# Altium project Bevattningssystem.PrjPcb
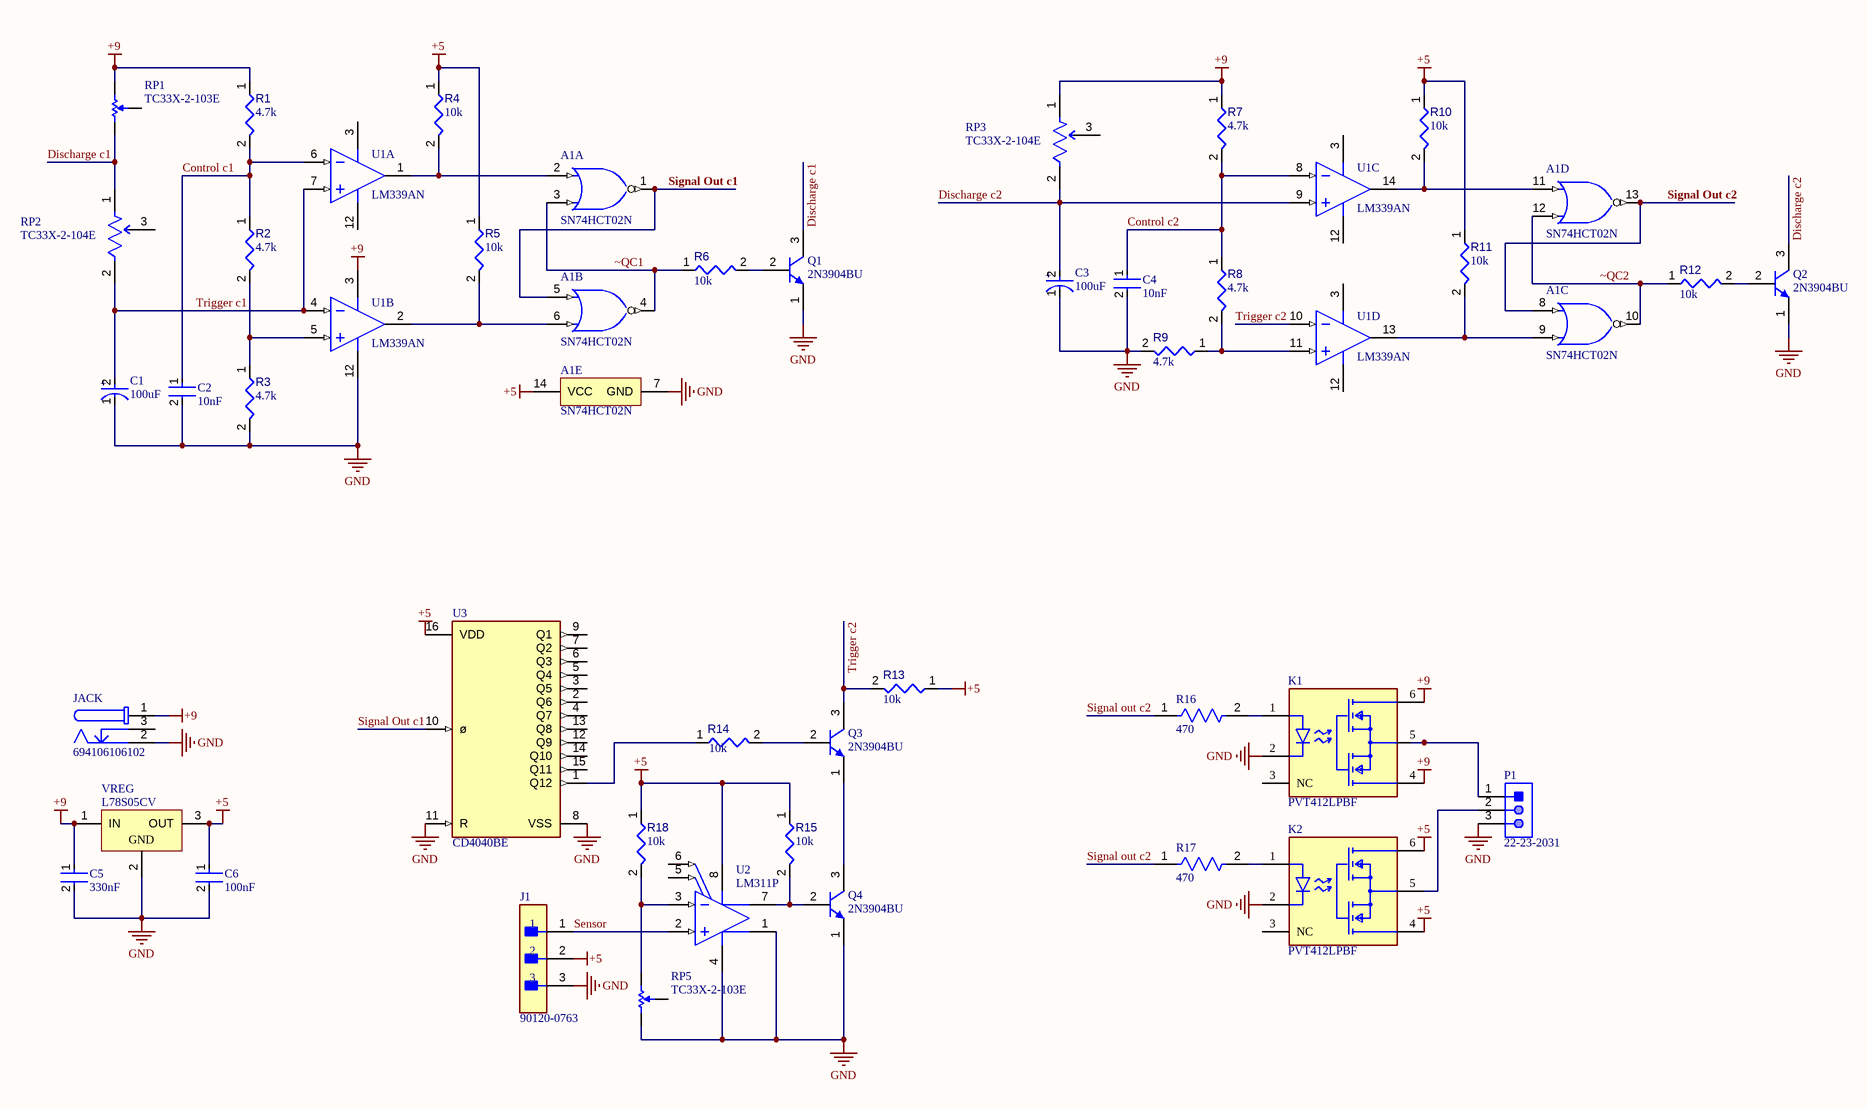
[diagram p0: Bevattningssystem.SchDoc]
1 sheet, 42 parts. Net scope: global (net labels, ports and power ports of the same name join across sheets).
Board file: Bevattningssystem.PcbDoc

## Sheet Bevattningssystem.SchDoc
size 431 x 279 mm; Organization: ORGANIZATION; Address1: ADDRESS 1; Address2: ADDRESS 2; Address3: ADDRESS 3; Address4: ADDRESS 4; Revision: -; SheetNumber: 1; SheetTotal: 1; ENG_APP_DATE: --/--/--; DSN_APP_DATE: --/--/--; CHK_APP_DATE: --/--/--

### Parts
A1  SN74HCT02N  [N0014A]  (parts A,B,C,D,E of 5)
C1  Capacitance: 100uF  [FP-RAD-TH-D_6_3_0_5-L_11-MFG]  (hidden comment: ECA1EHG101I)
C2  Capacitance: 10nF  [FP-GCM319-0_15-MFG]  (hidden comment: GCM3195C2A103JA16D)
C3  Capacitance: 100uF  [FP-RAD-TH-D_6_3_0_5-L_11-MFG]  (hidden comment: ECA1EHG101I)
C4  Capacitance: 10nF  [FP-GCM319-0_15-MFG]  (hidden comment: GCM3195C2A103JA16D)
C5  value 330nF  [FP-GCM31M-0_15-IPC_B]  (hidden comment: GCM31MR91H334KA37L)
C6  value 100nF  [FP-GRM31C-0_2-e0_3_0_8-IPC_C]  (hidden comment: GRM31C5C1H104JA01L)
J1  90120-0763  [FP-90120-0763-MFG]
JACK  694106106102  [694106106102]
K1  PVT412LPBF  [FP-PG-DIP-6-MFG]
K2  PVT412LPBF  [FP-PG-DIP-6-MFG]
P1  22-23-2031  [MOLX-22-23-2031_V]
Q1  2N3904BU  [FAIR-TO-92]
Q2  2N3904BU  [FAIR-TO-92]
Q3  2N3904BU  [FAIR-TO-92]
Q4  2N3904BU  [FAIR-TO-92]
R1  value 4.7k  [RESC3116X70X50ML13T20]  (hidden comment: Resistor 4k7 +/-1% 1206 250 mW)
R2  value 4.7k  [RESC3116X70X50ML13T20]  (hidden comment: Resistor 4k7 +/-1% 1206 250 mW)
R3  value 4.7k  [RESC3116X70X50ML13T20]  (hidden comment: Resistor 4k7 +/-1% 1206 250 mW)
R4  value 10k  [RESC3216X60X45ML15T20]  (hidden comment: Resistor 10k +/-1% 1206 250 mW)
R5  value 10k  [RESC3216X60X45ML15T20]  (hidden comment: Resistor 10k +/-1% 1206 250 mW)
R6  value 10k  [RESC3216X60X45ML15T20]  (hidden comment: Resistor 10k +/-1% 1206 250 mW)
R7  value 4.7k  [RESC3116X70X50ML13T20]  (hidden comment: Resistor 4k7 +/-1% 1206 250 mW)
R8  value 4.7k  [RESC3116X70X50ML13T20]  (hidden comment: Resistor 4k7 +/-1% 1206 250 mW)
R9  value 4.7k  [RESC3116X70X50ML13T20]  (hidden comment: Resistor 4k7 +/-1% 1206 250 mW)
R10  value 10k  [RESC3216X60X45ML15T20]  (hidden comment: Resistor 10k +/-1% 1206 250 mW)
R11  value 10k  [RESC3216X60X45ML15T20]  (hidden comment: Resistor 10k +/-1% 1206 250 mW)
R12  value 10k  [RESC3216X60X45ML15T20]  (hidden comment: Resistor 10k +/-1% 1206 250 mW)
R13  value 10k  [RESC3216X60X45ML15T20]  (hidden comment: Resistor 10k +/-1% 1206 250 mW)
R14  value 10k  [RESC3216X60X45ML15T20]  (hidden comment: Resistor 10k +/-1% 1206 250 mW)
R15  value 10k  [RESC3216X60X45ML15T20]  (hidden comment: Resistor 10k +/-1% 1206 250 mW)
R16  value 470  [FP-RT1206-IPC_C]  (hidden comment: RT1206BRD07470RL)
R17  value 470  [FP-RT1206-IPC_C]  (hidden comment: RT1206BRD07470RL)
R18  value 10k  [RESC3216X60X45ML15T20]  (hidden comment: Resistor 10k +/-1% 1206 250 mW)
RP1  TC33X-2-103E  [BOUR-TC33X-2_V]
RP2  TC33X-2-104E  [FP-TC33X-2-MFG]
RP3  TC33X-2-104E  [FP-TC33X-2-MFG]
RP5  TC33X-2-103E  [BOUR-TC33X-2_V]
U1  LM339AN  [TI-N0014A]  (parts A,B,C,D of 4)
U2  LM311P  [P0008A]
U3  CD4040BE  [FP-N0016A-MFG]
VREG  L78S05CV  [TO220]

### Nets
+5: A1.14(VCC) C6.1 J1.2 K2.4(2_DRAIN) K2.6(1_DRAIN) R4.1 R5.1 R10.1 R11.1 R13.1 R15.1 R18.1 U2.8(VCC+) U3.16(VDD) VREG.3(OUT)
+9: C5.1 JACK.1 K1.4(2_DRAIN) K1.6(1_DRAIN) R1.1 R7.1 RP1.2 RP3.1(CCW) U1.3(VCC) VREG.1(IN)
GND: A1.7(GND) C1.1(C) C2.2 C3.1(C) C4.2 C5.2 C6.2 J1.3 JACK.2 K1.2(C) K2.2(C) P1.3 Q1.1(E) Q2.1(E) Q4.1(E) R3.2 R9.2 RP5.1 U1.12(GND) U2.1(EMIT_OUT) U2.4(VCC-) U3.8(VSS) U3.11(R) VREG.2(GND)
Control c1: C2.1 R1.2 R2.1 U1.6(IN1-)
Control c2: C4.1 R7.2 R8.1 U1.8(IN3-)
Discharge c1: Q1.3(C) RP1.3 RP2.1(CCW)
Discharge c2: C3.2(A) Q2.3(C) RP3.2(WIPER) U1.9(IN3+)
Sensor: J1.1 U2.2(IN+)
Signal Out c1: A1.1(1Y) A1.5(2A) U3.10(ø)
Signal Out c2: A1.8(3A) A1.13(4Y) R16.1 R17.1
Trigger c1: C1.2(A) RP2.2(WIPER) U1.4(IN2-) U1.7(IN1+)
Trigger c2: Q3.3(C) R13.2 U1.10(IN4-)
~QC1: A1.3(1B) A1.4(2Y) R6.1
~QC2: A1.10(3Y) A1.12(4B) R12.1
NetA1_2: A1.2(1A) R4.2 U1.1(OUT1)
NetA1_6: A1.6(2B) R5.2 U1.2(OUT2)
NetA1_9: A1.9(3B) R11.2 U1.13(OUT4)
NetA1_11: A1.11(4A) R10.2 U1.14(OUT3)
NetK1_1: K1.1(A) R16.2
NetK1_5: K1.5(COMMON_SOURCE) P1.1
NetK2_1: K2.1(A) R17.2
NetK2_5: K2.5(COMMON_SOURCE) P1.2
NetQ1_2: Q1.2(B) R6.2
NetQ2_2: Q2.2(B) R12.2
NetQ3_1: Q3.1(E) Q4.3(C)
NetQ3_2: Q3.2(B) R14.2
NetQ4_2: Q4.2(B) R15.2 U2.7(COL_OUT)
NetR2_2: R2.2 R3.1 U1.5(IN2+)
NetR8_2: R8.2 R9.1 U1.11(IN4+)
NetR14_1: R14.1 U3.1(Q12)
NetR18_2: R18.2 RP5.3 U2.3(IN-)

Not connected (* = marked no-connect by the designer): JACK 3; K1 3(NC); K2 3(NC); RP1 1; RP2 3(CW); RP3 3(CW); RP5 2; U2 5(BALANCE) 6(BAL/STRB); U3 2(Q6) 3(Q5) 4(Q7) 5(Q4) 6(Q3) 7(Q2) 9(Q1) 12(Q9) 13(Q8) 14(Q10) 15(Q11)

### Notes on the sheet
- DWG. NO.
- REV.
- SHT.
- THIS DOCUMENT AND THE DATA DISCLOSED HEREIN OR HEREWITH IS THE PROPERTY OF ALTIUM LIMITED AND MAY BE FREELY DISTRIBUTED IN WHOLE. NO RIGHTS ARE RESERVED OR EXPRESS OR IMPLIED WARANTEE GIVEN.
- REVISION
- DESCRIPTION
- DATE
- APPROVED
- ENG:
- APPROVALS
- PROJECT
- DSN:
- CHK:
- REFERENCE DOCUMENTS
- PROJECT REVISION:
- TITLE
- DOCUMENT REVISION:
- DESIGN ITEM:
- BOM:
- FAB DWG:
- PCB DWG:
- ASSY DWG:
- SCALE:
- SIZE
- B
- CAGE CODE
- FILE NAME
- DWG NO.
- SHEET
- OF
- REV
- (in symbol CMP-05427-000141-1) +

### Library data of the parts
A1 = CMP-016-00012-1: NOR Gate, HCT Series, 4-Func, 2-Input, CMOS, PDIP14; Channels: 4; Load Capacitance (CL): 50pF; Max I(ol): 4mA; Max Supply Voltage: 5.5V; Min Supply Voltage: 4.5V; Nominal Supply Voltage: 5V; Number of Inputs: 2; Package Body Material: Plastic; Package Equivalence Code: DIP14,.3; Prop. Delay@Nom-Sup: 25ns; Qualification Status: Not Qualified; Schmitt Trigger: No; Surface Mount: No; Case/Package: DIP; Height - Seated (Max): 5.08mm; JESD-30 Code: R-PDIP-T14; JESD-609 Code: e4; Length: 19.305mm; Logic Type: NOR GATE; Max Operating Temperature: 85°C; Min Operating Temperature: -40°C; Package Shape: Rectangular; Package Style: IN-LINEMeter; Packaging: Rail/Tube; Pins: 14; Power Supplies: 5V; Propagation Delay (tpd): 25ns; Reach SVHC Compliant: Yes; RoHS Compliant: Yes; Technology: CMOS; Temperature Grade: INDUSTRIAL; Terminal Finish: Nickel; Terminal Form: Through Hole; Terminal Pitch: 2.54mm; Terminal Position: DUAL; Width: 7.62mm
C1 C3 = CMP-05427-000141-1: Aluminum Electrolytic Capacitors (Radial Lead Type) AEC-Q200 Qualified 100uF ±20% 25V; Lead Diameter: 0.5mm; Life (Hours): 1000Hour; Ripple Current: 130mA; Lead/Base Style: Straight; Construction: RADIAL; Radiation Hardening: No; Packaging: Ammo Pack; Termination: Radial; Mount: Through Hole; Lead Pitch: 2.5mm; Tolerance: 20%; Height - Seated (Max): 0.48inch; Height: 11.2mm; Max Operating Temperature: 105°C; Length: 11.2mm; Diameter: 6.3mm; RoHS Compliant: Yes; Voltage Rating: 25V; Min Operating Temperature: -55°C; Package Quantity: 2000; Width: 6.3mm; Voltage Rating (DC): 25V; Series: NHG; Contact Plating: Tin; Case/Package: Radial
C2 C4 = CMP-06035-000082-2: Ceramic Capacitor for Automotive 10nF ±5% 100VDC C0G 1206 Paper T/R; Voltage Rating (DC): 100V; Case/Package: 1206; Min Operating Temperature: -55°C; Width: 0.063inch; Packaging: Tape and Reel; Package Quantity: 1; Case Code (Metric): 3216; Thickness: 0.037inch; Case Code (Imperial): 1206; Dielectric: C0G; Radiation Hardening: No; Length: 3.2mm; Termination: SMD/SMT; Height: 0.85mm; Max Operating Temperature: 125°C; Depth: 1.6mm; Ratings: AEC-Q200; Tolerance: 5%; Voltage Rating: 100V; Mount: Surface Mount; Lead Free: Lead Free
C5 = CMP-001-00102-1: Ceramic Capacitor, Multilayer, Ceramic, 50V, 10% +Tol, 10% -Tol, X8R, 15% TC, 0.33uF, Surface Mount, 1206; Reference Standard: AEC-Q200; Multilayer: Yes; Terminal Finish: Nickel; Capacitor Type: Ceramic; Max Operating Temperature: 150°C; Termination: Wraparound; Pins: 2; RoHS Compliant: Yes; Mounting Technology: Surface Mount; Tolerance (fill in as +-): 10%; Packaging: Tape and Reel; Package Shape: Rectangular; Tolerance  (fill in as +-): 10%; Rated DC Voltage (URdc): 50V; Min Operating Temperature: -55°C; JESD-609 Code: e3; Dielectric Material: Ceramic; Case/Package: 1206; Temperature Characteristics Code: X8R; Reach SVHC Compliant: Yes
C6 = CMP-001-00099-1: Ceramic Capacitor, Non-polarized, Multilayer, Ceramic, 50V, 5% +Tol, 5% -Tol, C0G, 30ppm/Cel TC, 0.1uF, Surface Mount, 1206; Multilayer: Yes; Mounting Technology: Surface Mount; Width: 1.6mm; Min Operating Temperature: -55°C; Dielectric Material: Ceramic; JESD-609 Code: e3; Package Style: SMTMeter; Pins: 2; Terminal Finish: Nickel; Termination: Wraparound; Reach SVHC Compliant: Yes; Height: 1.6mm; Packaging: Tape and Reel; Tolerance  (fill in as +-): 5%; Capacitor Type: Ceramic; Case/Package: 1206; Max Operating Temperature: 125°C; Temperature Characteristics Code: C0G; Length: 3.2mm; Rated DC Voltage (URdc): 50V; Tolerance (fill in as +-): 5%; Polarity: Non-Polarized; Package Shape: Rectangular; RoHS Compliant: Yes
J1 = Pin Header 3: CONN HEADER VERT 3POS 2.54MM; Manufacturer: Molex; Voltage Rating: 350V; Number Of Contacts: 3; Conn Orientation: Vertical; Current Rating: 3A; Conn Gender: Male; Package: 90120-0763; ComponentLink2Description: Datasheet; Height: 5.8mm; Manufacturer Part Number: 90120-0763; Temperature Range High: +125°C; RoHS: TRUE; ComponentLink2URL: https://www.molex.com/webdocs/datasheets/pdf/en-us/0901200763_PCB_HEADERS.pdf; Device Class L2: Headers and Wire Housings; Temperature: -55°C to +125°C; Device Class L1: Connectors; Pitch: 2.54mm; Footprint Url: https://www.molex.com/pdm_docs/sd/901200763_sd.pdf; Device Class L3: unset; Temperature Range Low: -55°C; Number Of Rows: 1; Category: Conn; Lead Free: Yes; Mouser Description: Board-To-Board Connector, C-Grid III 90120 Series, Through Hole, Header, 3, 2.54 mm; Octopart: https://octopart.com/90120-0763-molex-655433; Contact Material: Gold,Nickel; Automotive: No; Digikey Description: CONN HEADER VERT 3POS 2.54MM
JACK = CMP-1502-00177-3: NexarPartId: 52645184; Connector Type: Power; Operating Supply Voltage: 24V; Shielding: Unshielded; Current Rating: 5A; Insulation Resistance: 100MΩ; Number of Contacts: 3; Gender: Male; Contact Plating: Tin; Contact Material: Gold, Tin; Color: Black; Flammability Rating: UL94 V-0; Height: 11.5mm; Termination: SMD/SMT; Housing Material: Polyamide; Voltage Rating (DC): 24V; Packaging: Tape and Reel; RoHS: Compliant; Contact Gender: Female; Voltage Rating: 24V; Mount: Surface Mount; REACH SVHC: Unknown; Min Operating Temperature: -40°C; Max Operating Temperature: 85°C
K1 K2 = CMP-00196-65875632-1: PVT412LPBF PVT Photovoltaic 400 V 0.12 A 35 Ohm SPST (1 Form A) Solid State Relay - DIP-6; Fall Time: 500µs; On-State Resistance: 35Ω; Insulation Resistance: 10GΩ; Throw Configuration: SP, SPST; Number of Poles: 1; Output Current: 120mA; Capacitance: 12pF; Input Current: 3mA; Max Supply Voltage: 400V; Approvals: UL; Isolation Voltage: 4kV; Max Input Current: 25mA; Rise Time: 2ms; Lifecycle Status: Production; Length: 8.63mm; Width: 6.47mm; RoHS: Compliant; NexarPartId: 65875632; Lead Free: Contains Lead; Ambient Temperature Range High: 85°C; Schedule B: 8541408000; Number of Channels: 1; RMS Current (Irms): 120mA; Package Quantity: 2000; Radiation Hardening: No; Termination: PC Pin; Load Current: 120mA; Max Operating Temperature: 85°C; Max Output Voltage: 400V; Height: 3.42mm; Output Voltage: 400V; Min Operating Temperature: -40°C; Relay Type: Relay; Case/Package: DIP; Resistance: 35Ω; Number of Contacts: 1; Mount: PCB, Through Hole; Number of Pins: 6; REACH SVHC: No SVHC; Forward Current: 25mA
P1 = CMP-2000-05242-1: Male Header, Pitch 2.54 mm, 1 x 3 Position, Height 8.18 mm, Tail Length 3.56 mm, RoHS, Bulk; Current Rating: 4A; Brand: Molex; Pitch: 2.54mm; Voltage Rating: 250V; Mounting Angle: Vertical; Type: Locking; Factory Pack Quantity: 16000; Tradename: KK; Housing Material: Nylon; Contact Material: Brass; Manufacturer URL: http://www.molex.com/; Termination Style: ThroughHole; Mounting Style: ThroughHole; Number of Positions: 3Position; Contact Gender: Pin(Male); Packaging: Bulk; Series: 6373; Datasheet Version: Sep-01; Contact Plating: Tin; Product: Headers; Datasheet URL: https://datasheet.ciiva.com/19472/232274-19472863.pdf; RoHS: Details; Product Category: Headers&WireHousings; Manufacturer: Molex; Number of Rows: 1Row
Q1-Q4 = CMP-013-00040-1: Small Signal Bipolar Transistor, 0.2A I(C), 40V V(BR)CEO, 1-Element, NPN, Silicon, TO-92; Frequency: 300MHz; DC Current Gain-Min (hFE): 30; Max Collector Current: 200mA; Number of Elements: 1; Package Body Material: Plastic; Power Dissipation-Max (Abs): 350mW; Qualification Status: Not Qualified; Surface Mount: No; Transistor Application: SWITCHING; Turn-off Time-Max (toff): 250ns; Turn-on Time-Max (ton): 70ns; Pins: 3; RoHS Compliant: Yes; Max Operating Temperature: 150°C; Collector-emitter Voltage-Max: 40V; JEDEC-95 Code: TO-92; JESD-30 Code: O-PBCY-T3; Package Shape: Round; Package Style: CYLINDRICALMeter; Polarity/Channel Type: NPN; Reach SVHC Compliant: Yes; Terminal Form: Through Hole; Terminal Position: BOTTOM; Transistor Element Material: SILICON
R1-R3 R7-R9 = CMP-009-00033-5: Chip Resistor, 4.7 KOhm, +/- 1%, 0.25 W, -55 to 155 degC, 1206 (3216 Metric); Power: 250mW; Voltage Rating: 200V; Mounting Technology: SM; Case/Package: 1206; Pins: 2; RoHS Compliant: True; Min Operating Temperature: -55°C; Max Operating Temperature: 155°C; Tolerance: 1%
R4-R6 R10-R14 R18 = CMP-009-00016-5: Chip Resistor, 10 KOhm, +/- 1%, 0.25 W, -55 to 155 degC, 1206 (3216 Metric); Power: 250mW; Voltage Rating: 200V; Pins: 2; Case/Package: 1206; Max Operating Temperature: 155°C; Min Operating Temperature: -55°C; Mounting Technology: SM; RoHS Compliant: True; Tolerance: 1%
R15 = CMP-009-00016-5: RP AND PQ1. / Chip Resistor, 10 KOhm, +/- 1%, 0.25 W, -55 to 155 degC, 1206 (3216 Metric); Power: 250mW; Voltage Rating: 200V; Pins: 2; Case/Package: 1206; Max Operating Temperature: 155°C; Min Operating Temperature: -55°C; Mounting Technology: SM; RoHS Compliant: True; Tolerance: 1%
R16 R17 = CMP-009-00218-1: Fixed Resistor, Thin Film, 0.25W, 470ohm, 200V, 0.1% +/-Tol, 25ppm/Cel, Surface Mount, 1206; Power: 250mW; Package Length: 3.1mm; Temperature Coefficient (ppm/Cel): 25; Package Width: 1.6mm; Package Height: 0.55mm; Rated Temperature: 70°C; Additional Feature: HIGH PRECISION; Mounting Technology: Surface Mount; Case/Package: 1206; Pins: 2; RoHS Compliant: Yes; Min Operating Temperature: -55°C; Max Operating Temperature: 155°C; Tolerance: 0.1%; Packaging: Tape and Reel; Working Voltage: 200V; Reach SVHC Compliant: Yes; Technology: THIN FILM; Construction: Chip; Resistor Type: FIXED RESISTOR; Termination: Wraparound
RP1 RP5 = CMP-009-00213-1: Trimmer, 0.1W, 10000ohm, 50V, 25% +/-Tol, -250,250ppm/Cel, 1 Turn(s), 1215; Manufacturer Series: TC33; Number of Turns: 1; Actuator Orientation: Vertical; Actuator Type: SCREW; Package Height: 1.2mm; Package Length: 3mm; Package Width: 3.8mm; Power: 100mW; Rated Temperature: 70°C; Resistance Law: Linear; Value: 10k; Tolerance: 25%; Termination: Wraparound; Case/Package: 1215; Min Operating Temperature: -40°C; Packaging: Tape and Reel; Max Operating Temperature: 100°C; Construction: Trimmer Pot; JESD-609 Code: e3; Mounting Technology: Surface Mount; Package Shape: Rectangular; Pins: 3; Reach SVHC Compliant: Yes; Resistor Type: TRIMMER; RoHS Compliant: Yes; Series: TC33; Temperature Coefficient (ppm/Cel): -250,250; Terminal Finish: Nickel; Working Voltage: 50V
RP2 RP3 = CMP-009-00214-1: Trimmer, 0.1W, 100000ohm, 50V, 25% +/-Tol, -250,250ppm/Cel, 1 Turn(s), 1215; Manufacturer Series: TC33; Number of Turns: 1; Actuator Orientation: Vertical; Actuator Type: SCREW; Package Height: 1.2mm; Package Length: 3mm; Package Width: 3.8mm; Power: 100mW; Rated Temperature: 70°C; Resistance Law: Linear; Value: 100k; Max Operating Temperature: 100°C; Termination: Wraparound; Packaging: Tape and Reel; RoHS Compliant: Yes; Min Operating Temperature: -40°C; Tolerance: 25%; Resistor Type: TRIMMER; Series: TC33; Case/Package: 1215; Construction: Trimmer Pot; JESD-609 Code: e3; Mounting Technology: Surface Mount; Package Shape: Rectangular; Pins: 3; Reach SVHC Compliant: Yes; Temperature Coefficient (ppm/Cel): -250,250; Terminal Finish: Tin; Working Voltage: 50V
U1 = CMP-014-00014-2: Quad Differential Comparator, 2 to 30 V, 0 to 70 degC, 14-Pin DIP (N), Pb-Free (RoHS), Tube; Manufacturer: Texas Instruments (TI); Max Supply Voltage: 30V; Power: 1.05W; Min Supply Voltage: 2V; Elements: 4; Max Dual Supply Voltage: 15V; Min Dual Supply Voltage: 1V; Nominal Supply Current: 500uA; Nominal Voltage Gain: 106.02dB; Max Operating Temperature: 70°C; Pins: 14; Case/Package: PDIP; Min Operating Temperature: 0°C; RoHS Compliant: True; Packaging: Rail/Tube; Mounting Technology: TH; Datasheet URL: http://www.ti.com/general/docs/lit/getliterature.tsp?genericPartNumber=LM339A&fileType=pdf; Datasheet Version: SLCS006S, 08/2012; Manufacturer URL: http://www.ti.com/; Package Description: 14-Pin Double In-line Package, Body 19.305 x 6.35 mm, Pitch 2.54 mm; Package Quantity: 25; Package Reference: N-14; Package URL: http://www.ti.com/lit/ml/mpdi002c/mpdi002c.pdf
U2 = CMP-014-00015-2: Quad Differential Comparator, 3.5 to 30 V, 0 to 70 degC, 8-Pin PDIP (P), Pb-Free (RoHS), Tube; Manufacturer: Texas Instruments (TI); Nominal Dual Supply Voltage: 12V; Channels: 1; Nominal Voltage Gain: 106.02dB; Propagation Delay: 115ns; Max Dual Supply Voltage: 15V; Min Dual Supply Voltage: 1.75V; Min Supply Voltage: 3.5V; Max Supply Voltage: 30V; Nominal Supply Current: 7.5mA; Package Version: 4040082/E, 04/2010; Mounting Technology: TH; RoHS Compliant: True; Pins: 8; Datasheet URL: http://www.ti.com/general/docs/lit/getliterature.tsp?genericPartNumber=LM311&fileType=pdf; Packaging: Rail/Tube; Package Quantity: 50; Max Operating Temperature: 70°C; Package Description: 8-Pin Double In-line Package, Body 9.59 x 6.35 mm, Pitch 2.54 mm; Nominal Supply Voltage: 12V; Datasheet Version: SLCS007I, 06/2015; Manufacturer URL: http://www.ti.com/; Package URL: http://www.ti.com/lit/ml/mpdi001b/mpdi001b.pdf; Package Reference: P0008A; Elements: 1; Min Operating Temperature: 0°C; Case/Package: PDIP
U3 = CMP-1623-00563-3: IC 12BIT BIN RIPPL COUNTER 16DIP; Manufacturer: Texas Instruments; Propagation Delay: 65ns; Min Supply Voltage: 3V; Standoff Height: 0.51mm; Quiescent Current: 0.04-0.08uA; Logic Function Desc: Non-Inverting; Sync Async: Asynchronous; Number Of Inputs: 1; Number Of Outputs: 12; Max Supply Voltage: 18V; Frequency: 12MHz; Automotive: No; Device Class L2: Logic ICs; Ambient Temperature Range High: +125°C; Temperature: -55°C to +125°C; Package: N0016A; ComponentLink2Description: Datasheet; Digikey Description: IC 12BIT BIN RIPPL COUNTER 16DIP; ComponentLink2URL: http://www.ti.com/lit/ds/symlink/cd4040b.pdf; Temperature Range Low: -55°C; Height: 5.08mm; Lead Free: Yes; Device Class L3: Counters; Ambient Temperature Range Low: -55°C; Manufacturer Part Number: CD4040BE; Number Of Circuits: 1; Octopart: https://octopart.com/cd4040be-texas+instruments-4776; Device Class L1: Integrated Circuits (ICs); Mouser Description: CMOS 12-Stage ipple-Carry Binary Counter/Divider 16-PDIP -55 to 125; RoHS: TRUE; Category: IC; Temperature Range High: +125°C
VREG = CMP-0244-00436-1: 2A Positive Voltage Regulator, 5V, 3-Pin TO-220; PackageVersion: ver3.0; ComponentLink2URL: http://www.st.com/internet/com/TECHNICAL_RESOURCES/TECHNICAL_LITERATURE/DATASHEET/CD00000449.pdf; ComponentLink1Description: Manufacturer URL; DatasheetVersion: 1/03/2010; PackageDescription: TO, Thru-Hole, Vertical, Heatsink Mounted; 3 In-Line Leads; Pitch 2.54 mm; ComponentLink2Description: Datasheet; ComponentLink1URL: http://www.st.com; ComponentLink3Description: Package Specification; PackageReference: TO220; ComponentLink3URL: http://www.st.com/internet/com/TECHNICAL_RESOURCES/TECHNICAL_LITERATURE/PACKAGE_INFORMATION/CD00004649.pdf